# Altium schematic sheet Sheet1.SchDoc: PWR_Block
size A4; DrawnBy: misaka10039; SheetNumber: 1; SheetTotal: 4
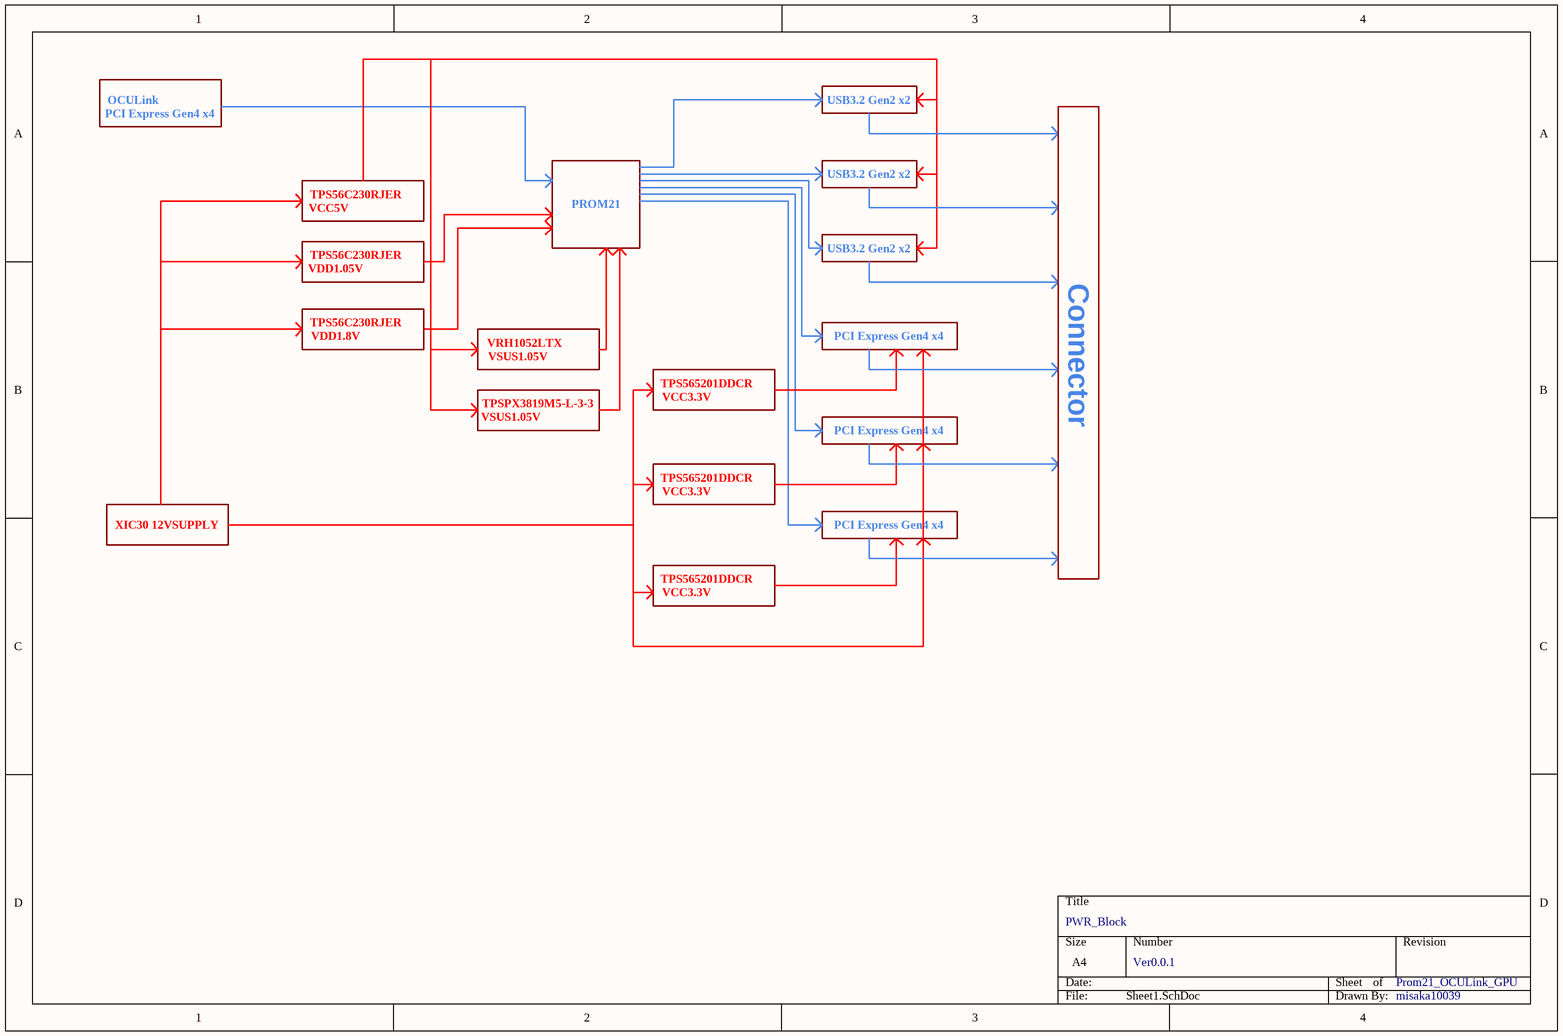
[diagram p0: Sheet1.SchDoc]

## Notes on the sheet
- OCULink
- PCI Express Gen4 x4
- USB3.2 Gen2 x2
- VCC5V
- TPS56C230RJER
- PROM21
- VDD1.05V
- VDD1.8V
- VSUS1.05V
- VRH1052LTX
- TPS565201DDCR
- Connector
- TPSPX3819M5-L-3-3
- VCC3.3V
- XIC30 12VSUPPLY
- PWR_Block
- Ver0.0.1
- Prom21_OCULink_GPU
- misaka10039